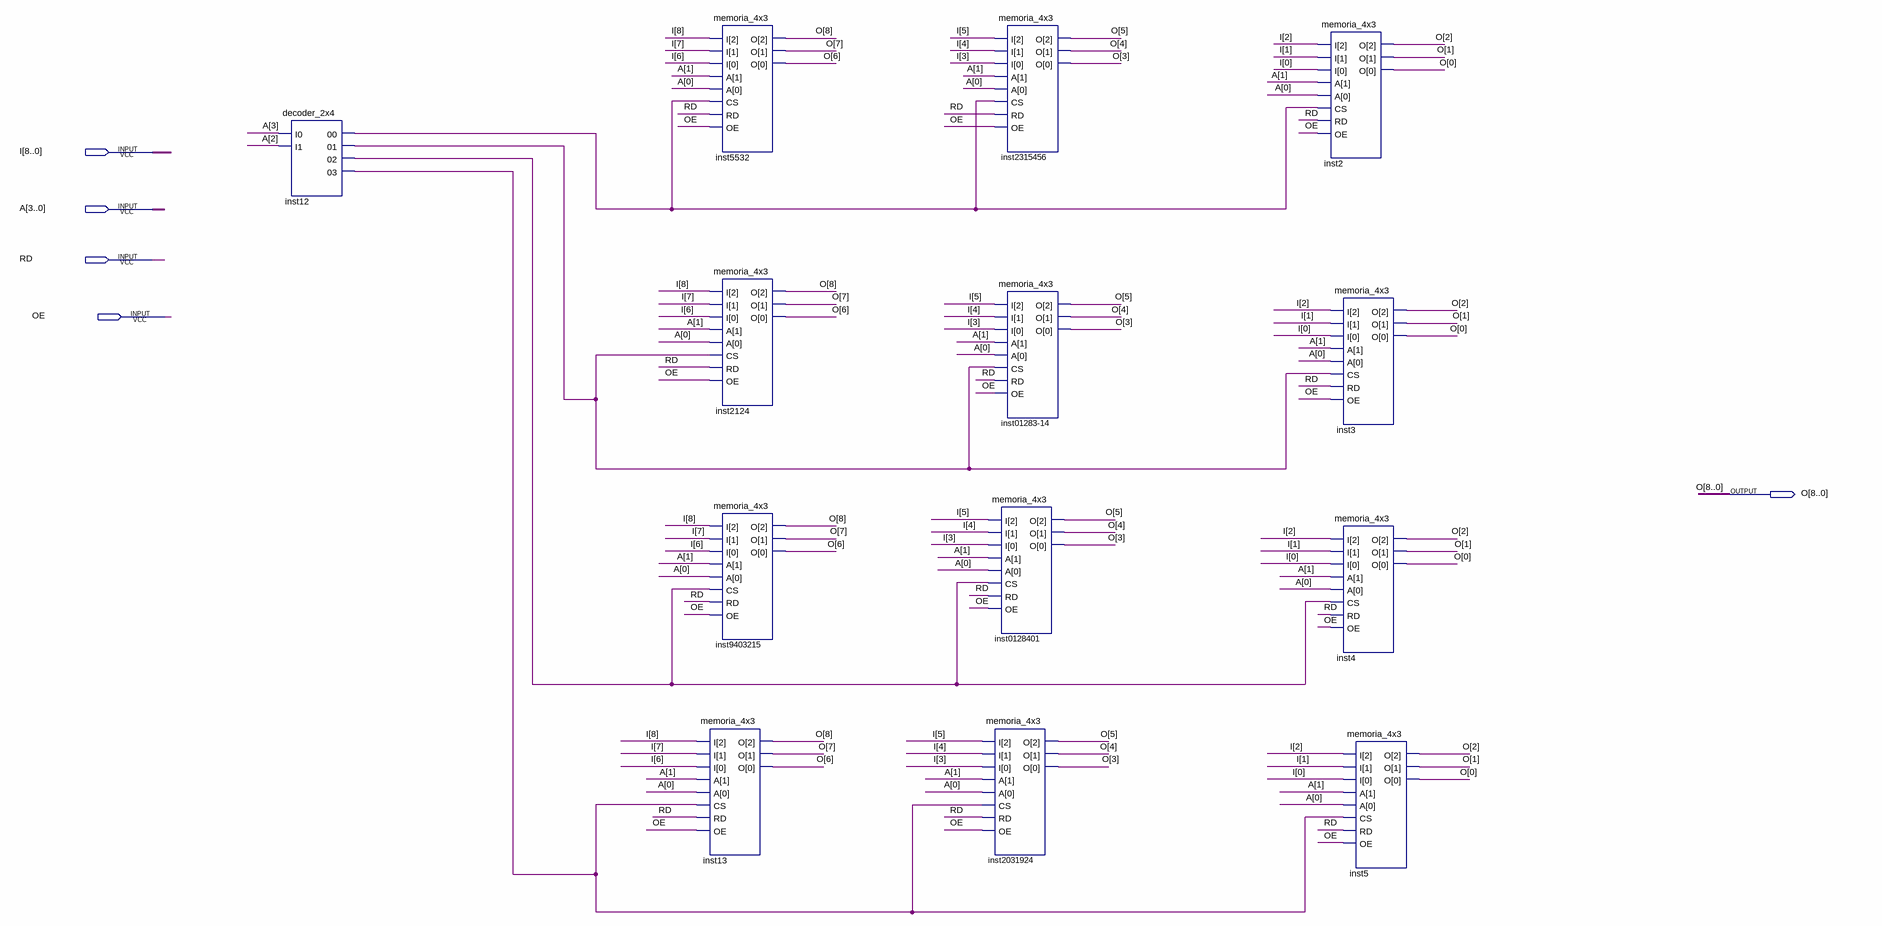
[diagram p0: schematic sheet]
// Quartus schematic memoria_16x9.bdf as structural Verilog: 13 symbols, 5 pins
module memoria_16x9 (
  input  [8:0] I,
  input  [3:0] A,
  input  RD,
  input  OE,
  output [8:0] O
);

  wire inst12_00, inst12_01, inst12_02, inst12_03;

  decoder_2x4 inst12 (.I0(A[3]), .I1(A[2]), .\00 (inst12_00), .\01 (inst12_01), .\02 (inst12_02), .\03 (inst12_03));
  memoria_4x3 inst13 (.I(I[8:6]), .A(A[1:0]), .CS(inst12_03), .RD(RD), .OE(OE), .O(O[8:6]));
  memoria_4x3 inst5532 (.I(I[8:6]), .A(A[1:0]), .CS(inst12_00), .RD(RD), .OE(OE), .O(O[8:6]));
  memoria_4x3 inst2124 (.I(I[8:6]), .A(A[1:0]), .CS(inst12_01), .RD(RD), .OE(OE), .O(O[8:6]));
  memoria_4x3 inst9403215 (.I(I[8:6]), .A(A[1:0]), .CS(inst12_02), .RD(RD), .OE(OE), .O(O[8:6]));
  memoria_4x3 inst2315456 (.I(I[5:3]), .A(A[1:0]), .CS(inst12_00), .RD(RD), .OE(OE), .O(O[5:3]));
  memoria_4x3 \inst01283-14  (.I(I[5:3]), .A(A[1:0]), .CS(inst12_01), .RD(RD), .OE(OE), .O(O[5:3]));
  memoria_4x3 inst0128401 (.I(I[5:3]), .A(A[1:0]), .CS(inst12_02), .RD(RD), .OE(OE), .O(O[5:3]));
  memoria_4x3 inst2031924 (.I(I[5:3]), .A(A[1:0]), .CS(inst12_03), .RD(RD), .OE(OE), .O(O[5:3]));
  memoria_4x3 inst2 (.I(I[2:0]), .A(A[1:0]), .CS(inst12_00), .RD(RD), .OE(OE), .O(O[2:0]));
  memoria_4x3 inst3 (.I(I[2:0]), .A(A[1:0]), .CS(inst12_01), .RD(RD), .OE(OE), .O(O[2:0]));
  memoria_4x3 inst4 (.I(I[2:0]), .A(A[1:0]), .CS(inst12_02), .RD(RD), .OE(OE), .O(O[2:0]));
  memoria_4x3 inst5 (.I(I[2:0]), .A(A[1:0]), .CS(inst12_03), .RD(RD), .OE(OE), .O(O[2:0]));
endmodule
